# Altium schematic sheet Hall sensor V1 power.SchDoc
size A4
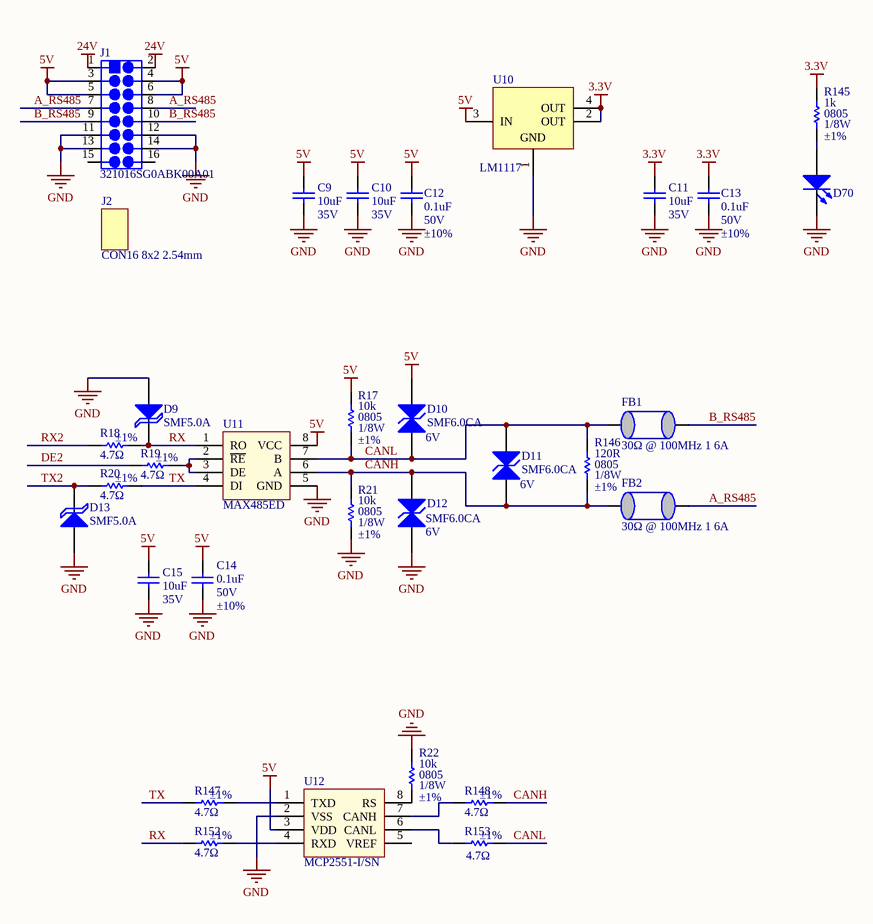
[diagram p0: Hall sensor V1 power.SchDoc]

## Parts
C9  Voltage: 35V  [CAP_SMD_0805]  (hidden comment: 10uF)
C10  Voltage: 35V  [CAP_SMD_0805]  (hidden comment: 10uF)
C11  Voltage: 35V  [CAP_SMD_0805]  (hidden comment: 10uF)
C12  Voltage: 50V  Tolerance: ±10%  [CAP_SMD_0805]  (hidden comment: 0.1uF)
C13  Voltage: 50V  Tolerance: ±10%  [CAP_SMD_0805]  (hidden comment: 0.1uF)
C14  Voltage: 50V  Tolerance: ±10%  [CAP_SMD_0805]  (hidden comment: 0.1uF)
C15  Voltage: 35V  [CAP_SMD_0805]  (hidden comment: 10uF)
D9  SMF5.0A  [SOD-123]
D10  SMF6.0CA  Voltage: 6V  [SOD-123]
D11  SMF6.0CA  Voltage: 6V  [SOD-123]
D12  Voltage: 6V  [SOD-123]  (hidden comment: SMF6.0CA)
D13  SMF5.0A  [SOD-123]
D70  17-21/R6C-AQ2R2B/3T  [LED_SMD0805]  (value not drawn)
FB1  30Ω @ 100MHz 1 6A  [Inductor 0805]
FB2  30Ω @ 100MHz 1 6A  [Inductor 0805]
J1  MANUFACTURER1_PART#: 321016SG0ABK00A01  [Header IDC 8x2 2.54mm through hold]  (hidden comment: header16 8x2 2.54mm)
J2  CON16 8x2 2.54mm  (mechanical)
R17  PCB Footprint: 0805  Power: 1/8W  Tolerance: ±1%  [RES_SMD_0805]  (hidden comment: 10k)
R18  value 4.7Ω  Tolerance: ±1%  [RES_SMD_0805]  (hidden comment: 4.7R)
R19  value 4.7Ω  Tolerance: ±1%  [RES_SMD_0805]  (hidden comment: 4.7R)
R20  value 4.7Ω  Tolerance: ±1%  [RES_SMD_0805]  (hidden comment: 4.7R)
R21  PCB Footprint: 0805  Power: 1/8W  Tolerance: ±1%  [RES_SMD_0805]  (hidden comment: 10k)
R22  PCB Footprint: 0805  Power: 1/8W  Tolerance: ±1%  [RES_SMD_0805]  (hidden comment: 10k)
R145  value 1k  PCB Footprint: 0805  Power: 1/8W  Tolerance: ±1%  [RES_SMD_0805]  (hidden comment: 10k)
R146  PCB Footprint: 0805  Power: 1/8W  Tolerance: ±1%  [RES_SMD_0805]  (hidden comment: 120R)
R147  value 4.7Ω  Tolerance: ±1%  [RES_SMD_0805]  (hidden comment: 4.7R)
R148  value 4.7Ω  Tolerance: ±1%  [RES_SMD_0805]  (hidden comment: 4.7R)
R152  value 4.7Ω  Tolerance: ±1%  [RES_SMD_0805]  (hidden comment: 4.7R)
R153  value 4.7Ω  Tolerance: ±1%  [RES_SMD_0805]  (hidden comment: 4.7R)
U10  LM1117  [SOT223]
U11  MAX485ED  [SOIC8]
U12  MCP2551-I/SN  [SOIC8]

## Nets
3.3V: C11.1 C13.2 R145.2 U10.2(OUT) U10.4(OUT)
5V: C9.1 C10.1 C12.2 C14.2 C15.1 D10.1(K) J1.3 J1.4 J1.5 J1.6 R17.2 U10.3(IN) U11.8(VCC) U12.3(VDD)
24V: J1.1 J1.2
GND: C9.2 C10.2 C11.2 C12.1 C13.1 C14.1 C15.2 D9.2(A) D12.2(A) D13.2(A) D70.1(A) J1.11 J1.12 J1.13 J1.14 R21.1 R22.2 U10.1(GND) U11.5(GND) U12.2(VSS)
A_RS485: FB2.2 J1.7 J1.8
B_RS485: FB1.2 J1.9 J1.10
CANH: D11.2(A) D12.1(K) FB2.1 R21.2 R146.1 R148.1 U11.6(A)
CANL: D10.2(A) D11.1(K) FB1.1 R17.1 R146.2 R153.1 U11.7(B)
DE2: R19.2
RX: D9.1(K) R18.1 R152.2 U11.1(RO)
RX2: R18.2
TX: R20.1 R147.2 U11.4(DI)
TX2: D13.1(K) R20.2
NetD70_2: D70.2(K) R145.1
NetR19_1: R19.1 U11.2(~{RE}) U11.3(DE)
NetR22_1: R22.1 U12.8(RS)
NetR147_1: R147.1 U12.1(TXD)
NetR148_2: R148.2 U12.7(CANH)
NetR152_1: R152.1 U12.4(RXD)
NetR153_2: R153.2 U12.6(CANL)

Not connected (* = marked no-connect by the designer): J1 15 16; J2 1 2; U12 5(VREF)

## Library data of the parts
C9-C11 C15 = Cap-NP-100: 10uF ±10% 35V X5R 0805 Multilayer Ceramic Capacitors MLCC - SMD/SMT RoHS; MANUFACTURER1: Murata Electronics; MANUFACTURER1_PART#: GRM21BR6YA106KE43L; MANUFACTURER2_PART#: C2012X5R1V106MT000E; PACKING: Tape & Reel (TR); PCB Footprint: 0805; Process Type: SM; Unit: PCS; By: Thanh Son; Value: 10uF; MANUFACTURER2: TDK; Tolerance: ±10%; Material: X5R; Category: Cap Cereramic; Mounting Type: SM; Package / Case: 0805; Supplier 1: LCSC
C12-C14 = Cap-NP-100: 100nF ±10% 50V X7R 0805 Multilayer Ceramic Capacitors MLCC - SMD/SMT RoHS; MANUFACTURER1: TORCH; MANUFACTURER1_PART#: C0805B104K500NT; MANUFACTURER2_PART#: TCC0805X7R104K500DT; PACKING: Tape & Reel (TR); PCB Footprint: 0805; Process Type: SM; Unit: PCS; By: Thanh Son; Value: 0.1uF; MANUFACTURER2: CCTC; Material: X7R; Category: Cap Cereramic; Mounting Type: SM; Package / Case: 0805; Supplier 1: LCSC
D9 D13 = TVS SMF26A: SOD-123FL TVS RoHS; MANUFACTURER1: Slkor(SLKORMICRO Elec.); Current: 4.8mA; PACKING: Tape & Reel; Process Type: SM; Unit: PCS; Value: SMF26A; By: Thanh Son; MANUFACTURER2: SUNMATE Elec; MANUFACTURER2_PART#: SMF5.0A; MANUFACTURER1_PART#: SMF5.0A; Category: ESD/TVS; Mounting Type: SM; Package / Case: SOD-123; Supplier 1: LCSC
D10-D12 = TVS SMF05CA  SOD123: Bidirectional 6V 6.67V 10.3V 19.4mA SOD-123FL TVS RoHS; MANUFACTURER1: SUNMATE Elec; PACKING: Tape & Reel; Process Type: SM; Unit: PCS; By: Thanh Son; MANUFACTURER1_PART#: SMF6.0CA; MANUFACTURER2: ZHIDE; MANUFACTURER2_PART#: SMF6.0CA; Category: ESD/TVS; Mounting Type: SM; Package / Case: SOD-123; Supplier 1: LCSC
D70 = LED_RED_SMD_0805: Red 617.5~633.5nm 0805 Light Emitting Diodes (LED) ROHS; MANUFACTURER1: Everlight Elec; MANUFACTURER2_PART#: HSMH-C170; PACKING: Tape & Reel (TR); Process Type: SM; Category: LED; MANUFACTURER1_PART#: 17-21/R6C-AQ2R2B/3T; MANUFACTURER2: AVAGO(Broadcom); Supplier 1: LCSC
FB1 FB2 = inductor ferrite bead: 30Ω @ 100MHz 1 6A 10mΩ 0805 Ferrite Beads ROHS; MANUFACTURER1: FH(Guangdong Fenghua Advanced Tech); MANUFACTURER1_PART#: CBM201209U300T; MANUFACTURER2_PART#: HCB2012KF-300T60; PACKING: Tape & Reel; Process Type: SM; By: Thanh Son; Category: Ferrite bead; MANUFACTURER2: TAI-TECH; Mounting Type: SM; Package / Case: 0805; Supplier 1: LCSC
J1 = header 8x2 JILN: 16 2 0.100"(2.54mm) Header Through Hole,P=2.54mm IDC Connectors ROHS; MANUFACTURER1: JILN; MANUFACTURER2_PART#: B-3000S16P-0110; Current: 3A; PACKING: Bag-packed; Process Type: SM; By: Thanh Son; Category: Connector; MANUFACTURER2: Ckmtw(Shenzhen Cankemeng); Package / Case: Header IDC 8x2; Supplier 1: LCSC; Mounting Type: MA
J2 = CON 2 WJ2EDGR-5.08-2P: 16 2 0.100"(2.54mm) - IDCconnector P=2.54mm IDC Connectors ROHS; MANUFACTURER1: JILN; MANUFACTURER1_PART#: 531416YBS0BW01; MANUFACTURER2_PART#: I-1010316P-B000; Current: 3A; PACKING: Bag-packed; Process Type: ASY; Unit: PCS; By: Thanh Son; MANUFACTURER2: Ckmtw(Shenzhen Cankemeng); Category: Connector; Mounting Type: ASY; Supplier 1: LCSC
R17 R21 R22 = Res0.3: 10kΩ ±1% 1/8W ±100ppm/℃ 0805 Chip Resistor - Surface Mount RoHS; MANUFACTURER1: UNI-ROYAL(Uniroyal Elec); MANUFACTURER1_PART#: 0805W8F1002T5E; MANUFACTURER2_PART#: RS-05K1002FT; PACKING: Tape & Reel (TR); Process Type: SM; Unit: PCS; By: Thanh Son; Value: 10k; MANUFACTURER2: FH(Guangdong Fenghua Advanced Tech); Category: Resistor; Mounting Type: SM; Package / Case: 0805; Supplier 1: LCSC
R18-R20 R147 R148 R152 R153 = Res0.3: 4.7Ω ±1% ±400ppm/℃ 0.125W 0805 Chip Resistor - Surface Mount ROHS; MANUFACTURER1: UNI-ROYAL(Uniroyal Elec); MANUFACTURER1_PART#: 0805W8F470KT5E; MANUFACTURER2_PART#: RC0805FR-074R7L; PACKING: Tape & Reel (TR); PCB Footprint: 0805; Process Type: SM; Unit: PCS; Power: 1/8W; MANUFACTURER2: YAGEO; Category: Resistor; Mounting Type: SM; Package / Case: 0805; Supplier 1: LCSC
R145 = Res0.3: 10kΩ ±1% 1/8W ±100ppm/℃ 0805 Chip Resistor - Surface Mount RoHS; MANUFACTURER1: YAGEO; MANUFACTURER1_PART#: AC0805FR-071KL; MANUFACTURER2_PART#: WR08X1001FTL; PACKING: Tape & Reel (TR); Process Type: SM; Unit: PCS; By: Thanh Son; MANUFACTURER2: Walsin Tech Corp; Category: Resistor; Mounting Type: SM; Package / Case: 0805; Supplier 1: LCSC
R146 = Res0.3: ±1% ±100ppm/℃ 120Ω 0.125W 0805 Chip Resistor - Surface Mount ROHS; MANUFACTURER1: UNI-ROYAL(Uniroyal Elec); MANUFACTURER1_PART#: 0805W8F1200T5E; MANUFACTURER2_PART#: AC0805FR-7W120RL; PACKING: Tape & Reel (TR); Process Type: SM; Unit: PCS; By: Thanh Son; Value: 120R; MANUFACTURER2: YAGEO; Category: Resistor; Mounting Type: SM; Package / Case: 0805; Supplier 1: LCSC
U10 = LM1117: Fixed 18V 3.3V 1.4V @ 1A SOT-223 Dropout Regulators(LDO) RoHS; MANUFACTURER1: Slkor(SLKORMICRO Elec.); MANUFACTURER1_PART#: AMS1117-3.3; PACKING: Tape & Reel; Process Type: SM; Unit: PCS; By: Thanh Son; MANUFACTURER2: PUOLOP; MANUFACTURER2_PART#: AMS1117-3.3; Value: 3.3V; Current: 1A; Voltage: 3.3V; Category: IC; Mounting Type: SM; Package / Case: SOT223; Supplier 1: LCSC
U11 = RS 485 SIT3485ESA: Transceiver RS485 1/1 200kbps SOIC-8_150mil RS-485/RS-422 ICs RoHS; MANUFACTURER1: HTC Korea TAEJIN Tech; MANUFACTURER2_PART#: CBM485AS8; PACKING: Tape & Reel; Process Type: SM; Unit: PCS; By: Thanh Son; MANUFACTURER1_PART#: MAX485ED; MANUFACTURER2: Corebai Microelectronics; Category: IC; Mounting Type: SM; Package / Case: SOP-8; Supplier 1: LCSC
U12 = CAN MCP2551-I/SN: Transceiver 1/1 CAN - SOIC-8_150mil CAN ICs ROHS; MANUFACTURER1: Microchip Tech; MANUFACTURER2_PART#: PCA82C250T/YM,118; PACKING: Tape & Reel; Process Type: SM; Unit: PCS; By: Thanh Son; Category: IC; MANUFACTURER1_PART#: MCP2551-I/SN; MANUFACTURER2: NXP Semicon; Mounting Type: SM; Package / Case: SOIC8; Supplier 1: LCSC